# EAGLE design controller13 (EAGLE 8.3.1)

## Sheet 1 of 2
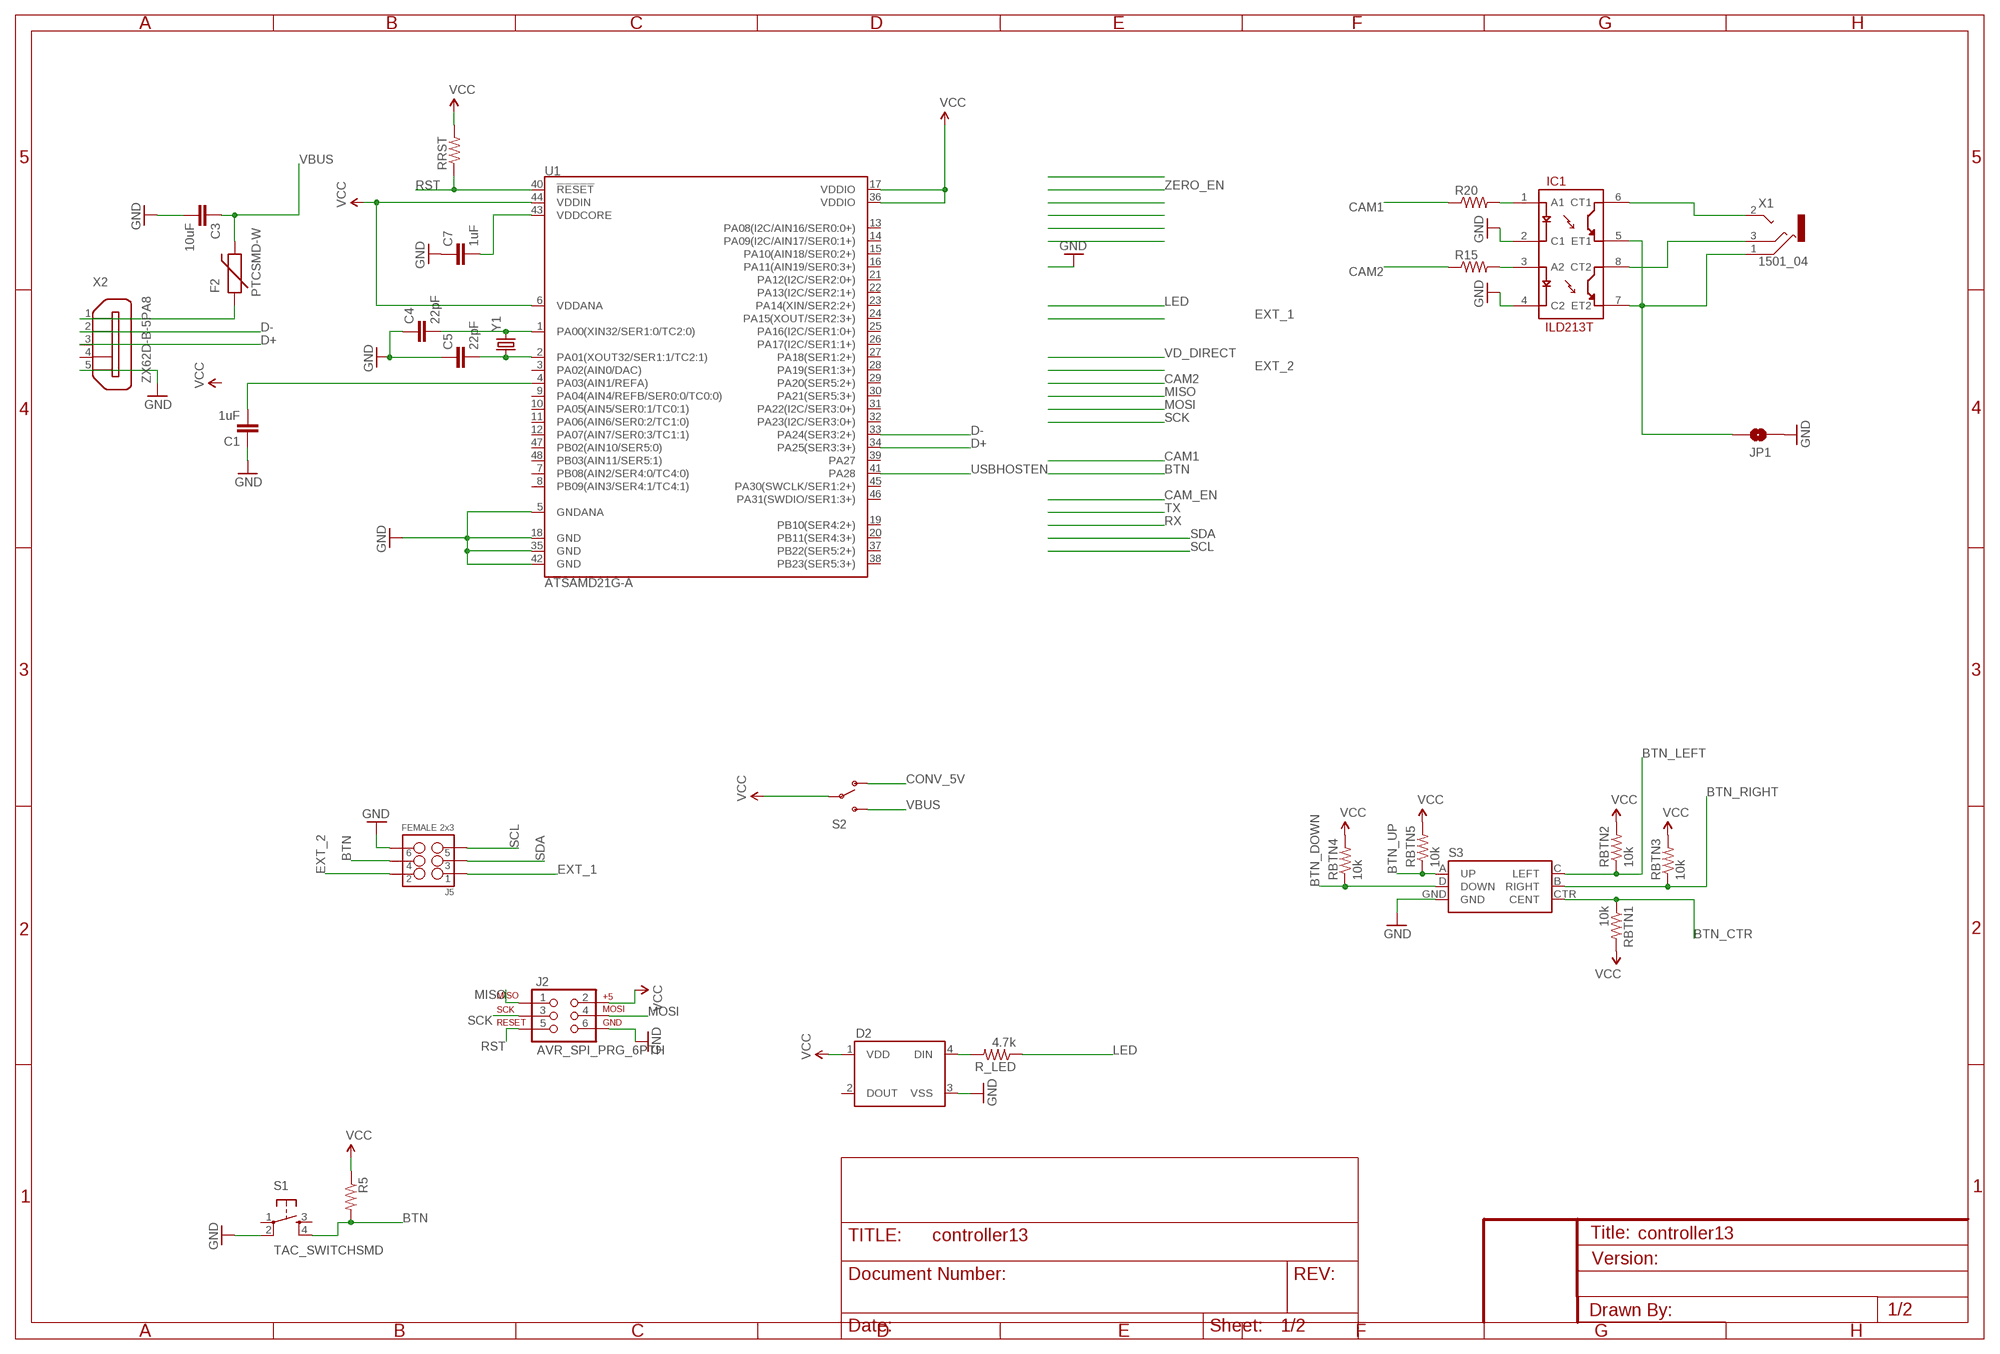
[diagram p0: schematic, sheet 1]

### Parts
C1  1uF  CAP1206  [1206]
C3  10uF  CAP1206  [1206]
C4  22pF  CAP0805  [0805]
C5  22pF  CAP0805  [0805]
C7  1uF  CAP1206  [1206]
D2  WS2812B  [WS2812B]
F2  PTCSMD-W  [PTC-1206-WIDE]
IC1  ILD213T  [SO08]
J2  AVR_SPI_PRG_6PTH  [2X3]
J5  FEMALE 2x3  M03X2FEMALE  [2X3]
JP1  JUMPER-PAD-2-NOYES_SILK  [PAD-JUMPER-2-NO_YES_SILK]
R5  RESISTOR1206  [1206]
R15  RESISTOR1206  [1206]
R20  RESISTOR1206  [1206]
R_LED  4.7k  RESISTOR1206  [1206]
RBTN1  10k  RESISTOR0805-RES  [0805]
RBTN2  10k  RESISTOR0805-RES  [0805]
RBTN3  10k  RESISTOR0805-RES  [0805]
RBTN4  10k  RESISTOR0805-RES  [0805]
RBTN5  10k  RESISTOR0805-RES  [0805]
RRST  RESISTOR0805-RES  [0805]
S1  TAC_SWITCHSMD  TAC_SWITCHPTH  [TACTILE-PTH]
S2  SWITCH-SPDTSMD2  [SWITCH-SPDT-SMD]
S3  JOYSTICK_MINI  [JOYSTICK_MINI]
U1  ATSAMD21G-A  [TQFP-48]
X1  1501_04  [1501_05]
X2  ZX62D-B-5PA8  [ZX62D-B-5PA8]
Y1  CRYSTALCRYSTAL-SMD-5X3-16MHZ  [CRYSTAL-SMD-5X3]

### Nets
BTN: J5.4 R5.2 S1.4
BTN_CTR: RBTN1.1 S3.CTR(CENT)
BTN_DOWN: RBTN4.1 S3.D(DOWN)
BTN_LEFT: RBTN2.1 S3.C(LEFT)
BTN_RIGHT: RBTN3.1 S3.B(RIGHT)
BTN_UP: RBTN5.1 S3.A(UP)
CAM1: R20.1
CAM2: R15.1
CONV_5V [power]: S2.1(O) ; also sheet 2
D+: U1.34(PA25(SER3:3+)) X2.3
D-: U1.33(PA24(SER3:2+)) X2.2
EXT_1: J5.1
EXT_2: J5.2
GND: C1.1 C3.2 C4.1 C5.1 C7.1 D2.3(VSS) IC1.2(C1) IC1.4(C2) J2.6 J5.6 JP1.1 S1.2 S3.GND U1.5(GNDANA) U1.18(GND) U1.35(GND) U1.42(GND) X2.5 ; also sheet 2
LED: R_LED.1
MISO: J2.1
MOSI: J2.4
N$2: C7.2 U1.43(VDDCORE)
N$3 [power]: C1.2
N$7: D2.4(DIN) R_LED.2
N$8: C4.2 Y1.3
N$9: C5.2 Y1.1
N$12: IC1.6(CT1) X1.2
N$13: IC1.8(CT2) X1.3
N$15: IC1.3(A2) R15.2
N$19: IC1.1(A1) R20.2
N$34: IC1.5(ET1) IC1.7(ET2) JP1.2 X1.1
N$38: F2.1 X2.1
RST: J2.5 RRST.1 U1.40(!RESET!)
SCK: J2.3
SCL: J5.5
SDA: J5.3
USBHOSTEN: U1.41(PA28)
VBUS: C3.1 F2.2 S2.3(S)
VCC [power]: D2.1(VDD) J2.2 R5.1 RBTN1.2 RBTN2.2 RBTN3.2 RBTN4.2 RBTN5.2 RRST.2 S2.2(P) U1.6(VDDANA) U1.17(VDDIO) U1.36(VDDIO) U1.44(VDDIN) ; also sheet 2
Unconnected: D2.2(DOUT) S1.1 S1.3 U1.1(PA00(XIN32/SER1:0/TC2:0)) U1.2(PA01(XOUT32/SER1:1/TC2:1)) U1.3(PA02(AIN0/DAC)) U1.4(PA03(AIN1/REFA)) U1.7(PB08(AIN2/SER4:0/TC4:0)) U1.8(PB09(AIN3/SER4:1/TC4:1)) U1.9(PA04(AIN4/REFB/SER0:0/TC0:0)) U1.10(PA05(AIN5/SER0:1/TC0:1)) U1.11(PA06(AIN6/SER0:2/TC1:0)) U1.12(PA07(AIN7/SER0:3/TC1:1)) U1.13(PA08(I2C/AIN16/SER0:0+)) U1.14(PA09(I2C/AIN17/SER0:1+)) U1.15(PA10(AIN18/SER0:2+)) U1.16(PA11(AIN19/SER0:3+)) U1.19(PB10(SER4:2+)) U1.20(PB11(SER4:3+)) U1.21(PA12(I2C/SER2:0+)) U1.22(PA13(I2C/SER2:1+)) U1.23(PA14(XIN/SER2:2+)) U1.24(PA15(XOUT/SER2:3+)) U1.25(PA16(I2C/SER1:0+)) U1.26(PA17(I2C/SER1:1+)) U1.27(PA18(SER1:2+)) U1.28(PA19(SER1:3+)) U1.29(PA20(SER5:2+)) U1.30(PA21(SER5:3+)) U1.31(PA22(I2C/SER3:0+)) U1.32(PA23(I2C/SER3:0+)) U1.37(PB22(SER5:2+)) U1.38(PB23(SER5:3+)) U1.39(PA27) U1.45(PA30(SWCLK/SER1:2+)) U1.46(PA31(SWDIO/SER1:3+)) U1.47(PB02(AIN10/SER5:0)) U1.48(PB03(AIN11/SER5:1)) X2.4 X2.S1 X2.S2 X2.S3 X2.S4

## Sheet 2 of 2
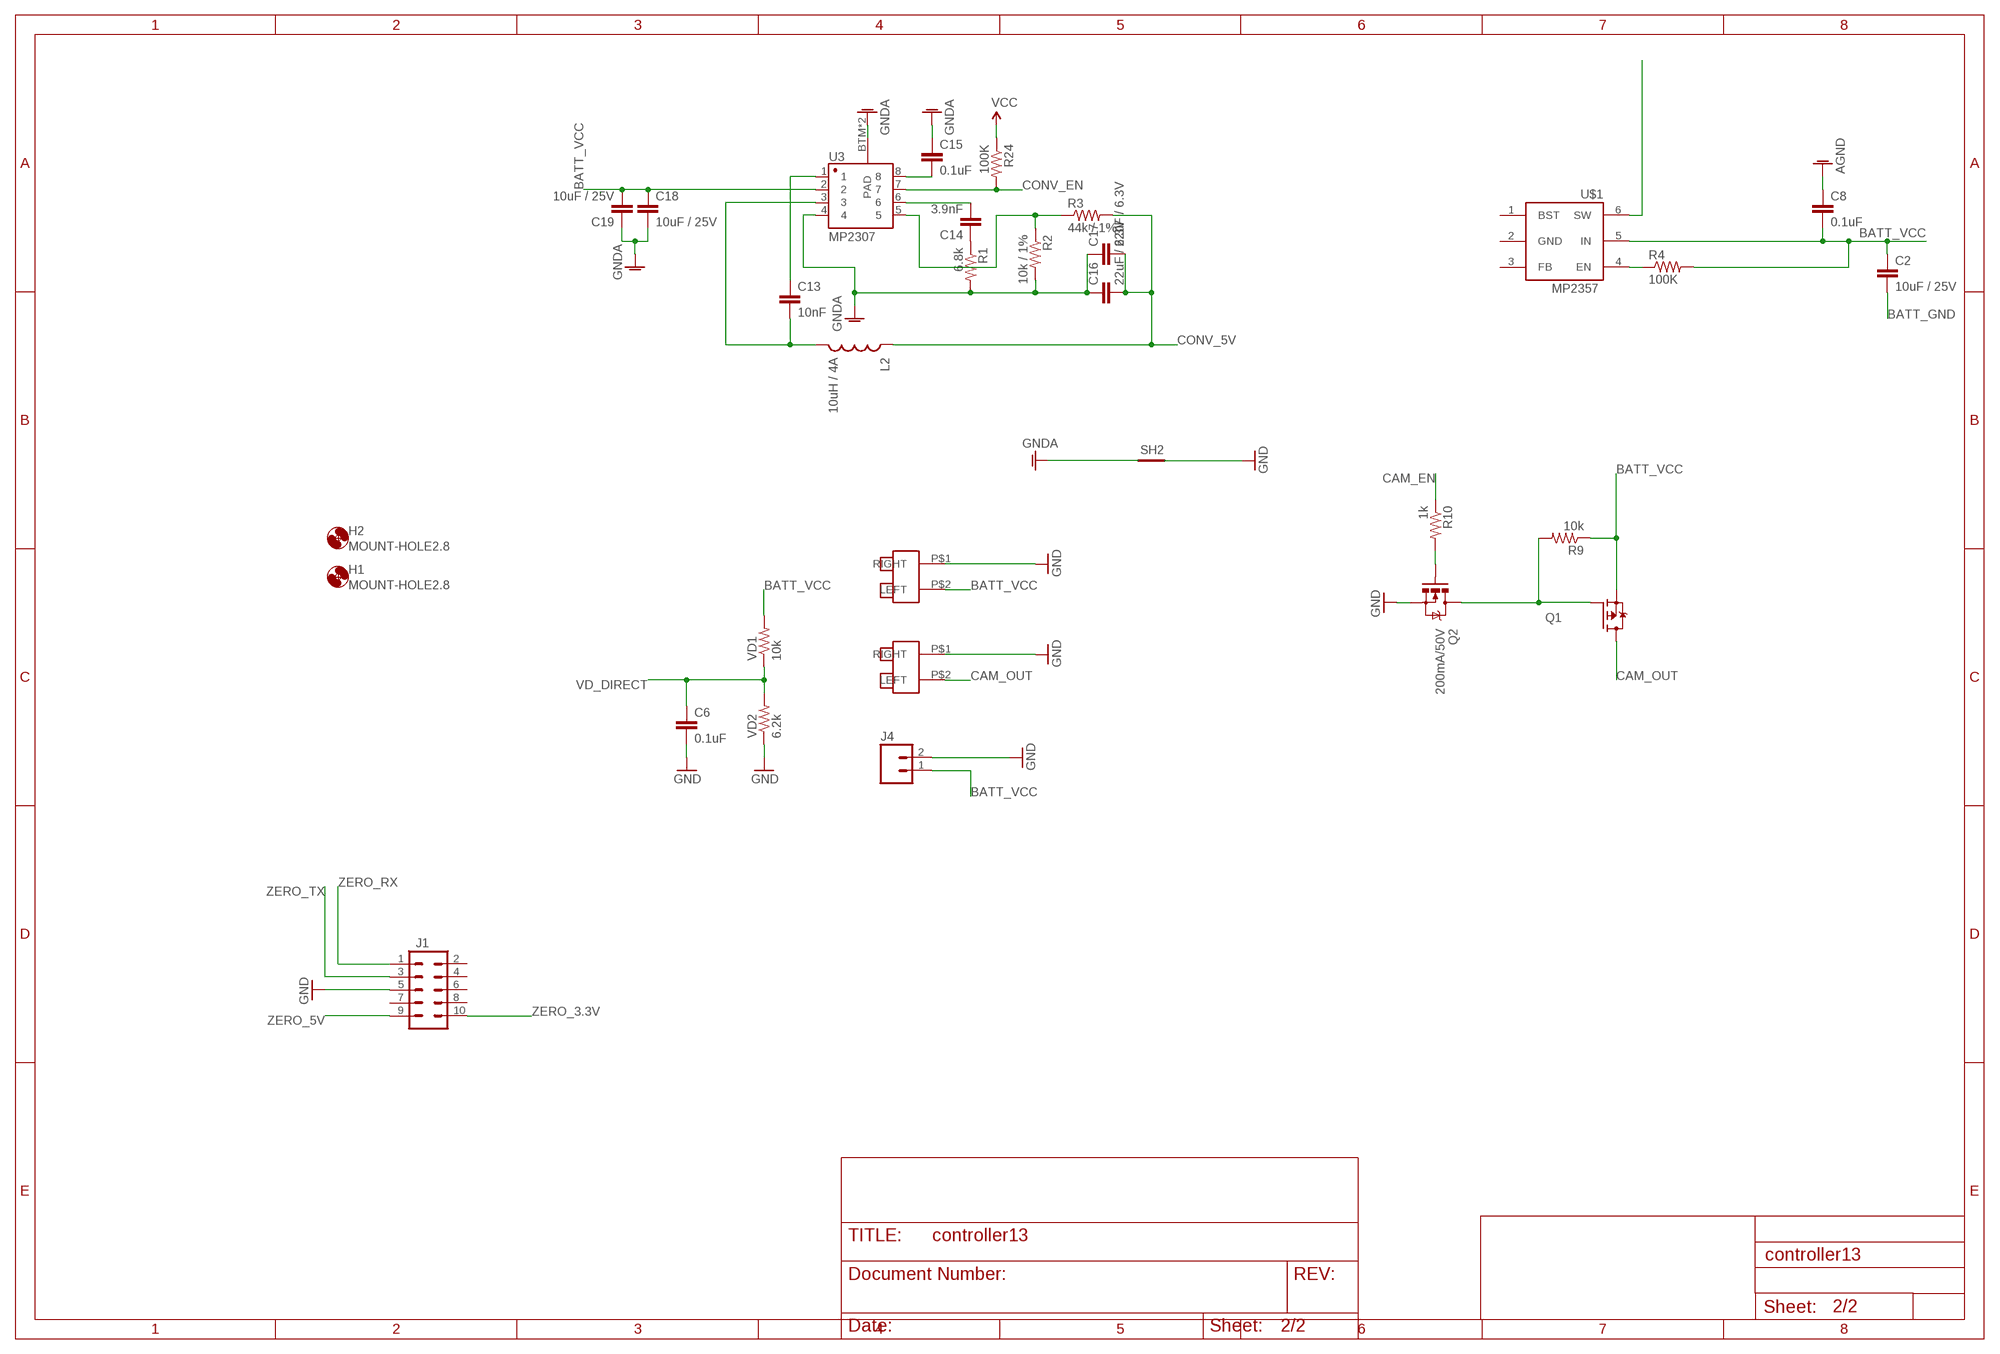
[diagram p1: schematic, sheet 2]

### Parts
C2  10uF / 25V  CAP1210  [1210]
C6  0.1uF  CAP1206  [1206]
C8  0.1uF  CAP0805  [0805]
C13  10nF  CAP1206  [1206]
C14  3.9nF  CAP1206  [1206]
C15  0.1uF  CAP0805  [0805]
C16  22uF / 6.3V  CAP1210  [1210]
C17  22uF / 6.3V  CAP1210  [1210]
C18  10uF / 25V  CAP1210  [1210]
C19  10uF / 25V  CAP1210  [1210]
H1  MOUNT-HOLE2.8  [2,8]
H2  MOUNT-HOLE2.8  [2,8]
J1  M05X2PTH  [AVR_ICSP]
J4  M02PTH  [1X02]
L2  10uH / 4A  INDUCTORSRU1038  [SRU1038]
Q1  FDD4141TO252  [TO252]
Q2  200mA/50V  MOSFET-NCHANNELBSS138  [SOT23-3]
R1  6.8k  RESISTOR0805-RES  [0805]
R2  10k / 1%  RESISTOR1206  [1206]
R3  44k / 1%  RESISTOR1206  [1206]
R4  100K  RESISTOR0805-RES  [0805]
R9  10k  RESISTOR1206  [1206]
R10  1k  RESISTOR1206  [1206]
R24  100K  RESISTOR0805-RES  [0805]
SH2  SHORT-HT5  [SHORT_TOP-50]
U3  MP2307  GENERIC-SOIC8MSGEQ7N-FILTER  [SO08]
U$1  MP2357  [SOT23-6]
U$4  NANOFIT2  [NANOFIT2]
U$5  NANOFIT2  [NANOFIT2]
VD1  10k  RESISTOR1206  [1206]
VD2  6.2k  RESISTOR1206  [1206]

### Nets
AGND: C8.1
BATT_GND: C2.2
BATT_VCC [camera_power]: C2.1 C8.2 C18.1 C19.2 J4.1 Q1.2(S) R4.2 R9.1 U3.2 U$1.5(IN) U$4.P$2(LEFT) VD1.2
CAM_EN: R10.1 ; also sheet 1
CAM_OUT [camera_power]: Q1.3(D) U$5.P$2(LEFT)
CONV_5V [power]: C16.2 C17.2 L2.1 R3.2 ; also sheet 1
CONV_EN: R24.2 U3.7
GND: C6.2 J1.5 J4.2 Q2.2(S) SH2.2 U$4.P$1(RIGHT) U$5.P$1(RIGHT) VD2.1 ; also sheet 1
GNDA [power]: C15.1 C16.1 C17.1 C18.2 C19.1 R1.2 R2.2 SH2.1 U3.4 U3.BTM(PAD) U3.P$1(PAD)
N$1: Q1.1(G) Q2.3(D) R9.2
N$4: R4.1 U$1.4(EN)
N$5: U$1.6(SW)
N$6: Q2.1(G) R10.2
N$25: C15.2 U3.8
N$26 [power]: C13.2 L2.2 U3.3
N$27: C13.1 U3.1
N$28: C14.1 R1.1
N$29: C14.2 U3.6
N$30: R2.1 R3.1 U3.5
VCC [power]: R24.1 ; also sheet 1
VD_DIRECT: C6.1 VD1.1 VD2.2 ; also sheet 1
ZERO_3.3V: J1.10
ZERO_5V [power]: J1.9
ZERO_RX: J1.1
ZERO_TX: J1.3
Unconnected: J1.2 J1.4 J1.6 J1.7 J1.8 U$1.1(BST) U$1.3(FB)

## Power pins joined to a net without a drawn wire
GND: U$1.2(GND)

## Library data of the parts
C1 C2 C6-C8 C13-C19 = SparkFun-Capacitors:CAP: Capacitor Standard 0603 ceramic capacitor, and 0.1" leaded capacitor.
C3-C5 = SparkFun-Passives:CAP: Capacitor Standard 0603 ceramic capacitor, and 0.1" leaded capacitor.
D2 = SparkFun-LED:WS2812B: WS2812B - Intelligent control LED integrated light source Technical Specifications: Power Supply Voltage (VDD): 3.5 to 5.3 V Input Voltage (VI): -0.5 to VDD+0.5 V Operating Junction Temperature (Topt): -25°C to +80°C Storage Temperature Range (Tstg): -55°C to +150°C; PROD_ID: DIO-12503
F2 = SparkFun-PowerIC:PTC: Resettable Fuse PTC Resettable Fuse. Spark Fun Electronics SKU : COM-08357
H1 H2 = holes:MOUNT-HOLE: MOUNTING HOLE with drill center marker
IC1 = SparkFun-DiscreteSemi:ILD213T: Dual optoisolator.
J1 = SparkFun-Connectors:M05X2: Header 5x2 Standard 10-pin dual row 0.1" header. Commonly used with AVR-ISP. Use with Spark Fun Electronics SKU: PRT-00778
J2 = SparkFun-Connectors:AVR_SPI_PRG_6: AVR ISP 6 Pin This is the reduced ISP connector for AVR programming. Common on Arduino. This footprint will take up less PCB space and can be used with a 10-pin to 6-pin adapter such as SKU: BOB-08508 **Special note about "TEST_POINT" package. The stop mask is on the top side, so if you want your programming test points to be on the bottom of your board, make sure to place this package on the bottom side of the board. This also ensure that the orientation to program from the bottom side will be correct.
J4 = SparkFun-Connectors:M02: Standard 2-pin 0.1" header. Use with - straight break away headers ( PRT-00116) - right angle break away headers (PRT-00553) - swiss pins (PRT-00743) - machine pins (PRT-00117) - female headers (PRT-00115) Molex polarized connector foot print use with: PRT-08233 with associated crimp pins and housings. 2.54_SCREWTERM for use with PRT-10571. 3.5mm Screw Terminal footprints for PRT-08084 5mm Screw Terminal footprints for use with PRT-08432
J5 = SparkFun-Connectors:M03X2: 2x3 .1" header. Shrouded, with keying- CONN-10681 SMT- CONN-11415 Pogo pins- HW-11044; PROD_ID: CONN-11566
JP1 = SparkFun-Passives:JUMPER-PAD-2-NO
L2 = SparkFun-Passives:INDUCTOR: Inductors Basic Inductor/Choke - 0603 and 1206. Footprints are not proven and vary greatly between part numbers. INDUCTOR POWER 3.3UH 4.0A SMD 0.197" L x 0.197" W x 0.177" H (5.00mm x 5.00mm x 4.50mm)
Q1 = transistor-fet:FDD4141: P-Channel PowerTrench® MOSFET Source: FDD4141.pdf
Q2 = SparkFun-DiscreteSemi:MOSFET-NCHANNEL: Common NMOSFET Parts MFG P/N Store ID Prod ID FDD8780 TRANS-09984 SI7820DN TRANS-11055 FDS6630A IC-08089 2N7002PW TRANS-11151 FQP30N06L COM-10213 TRANS-10060 BSS123LT1G TRANS-08345 BSS138 TRANS-00830 BS170 2N7000; PROD_ID: TRANS-00830
R1-R4 R9 R10 R24 R_LED RBTN1-RBTN5 = SparkFun-Resistors:RESISTOR: Resistor Basic schematic elements and footprints for 0603, 1206, and PTH resistors.
R5 R15 R20 RRST VD1 VD2 = SparkFun-Passives:RESISTOR: Resistor Basic schematic elements and footprints for 0603, 1206, and PTH resistors.
S1 = SparkFun-Retired:TAC_SWITCH: Momentary Switch Button commonly used for reset or general input. Spark Fun Electronics SKU : COM-00097 SMT- SWCH-08247
S2 = SparkFun-Electromechanical:SWITCH-SPDT: SPDT Switch Simple slide switch, Spark Fun Electronics SKU : COM-00102 DPDT SMT slide switch, AYZ0202, SWCH-08179
S3 = SparkFun-Electromechanical:JOYSTICK_MINI: Small 5-way tactile joystick, COM-10063 4UCON SF303GJ26; PROD_ID: SWCH-09905
SH2 = shorts:SHORT-H: Short between two nets; BOM: no
U1 = SparkFun-DigitalIC:ATSAMD21G: Atmel SAMD21G SMART ARM-Based Microcontroller The Atmel ® | SMART ™ SAM D21 is a series of low-power microcontrollers using the 32-bit ARM ® Cortex ® -M0+ processor, and ranging from 32- to 64-pins with up to 256KB Flash and 32KB of SRAM. The SAM D21 devices operate at a maximum frequency of 48MHz and reach 2.46 CoreMark/MHz. They are designed for simple and intuitive migration with identical peripheral modules, hex compatible code, identical linear address map and pin compatible migration paths between all devices in the product series. All devices include intelligent and flexible peripherals, Atmel Event System for inter-peripheral signaling, and support for capacitive touch button, slider and wheel user interfaces.; PROD_ID: IC-13064
U3 = SparkFun-AnalogIC:GENERIC-SOIC8: A placeholder for generic narrow & wide SOIC8 foorptints - used on the DIP adapter board.; PROD_ID: IC-10141
U$1 = volzolib:MP2357
U$4 U$5 = volzolib:NANOFIT2
X1 = con-lumberg:1501_0*: Jack connectors according to JISC 6560, 2.5 mm Klinkensteckverbinder nach JISC 6560, 2,5 mm Source: http://www.lumberg.com/Produkte/PDFs/1501_05.pdfedit 1501_03 http://www.lumberg.com/Produkte/PDFs/1501_06.pdf; OC_FARNELL: 1216977; OC_NEWARK: unknown
X2 = zx62d-b-5pa8-oshpark_10:ZX62D-B-5PA8: Micro USB Type B Connector - Standard, Shell Through Hole Source: http://www.hirose.co.jp/cataloge_hp/ed_ZX_20140804.pdf; MF: Hirose; MPN: ZX62D-B-5PA8; OC_FARNELL: 2300438; OC_NEWARK: 69W0712
Y1 = SparkFun-FreqCtrl:CRYSTAL: Various standard crystals. Proven footprints.; PROD_ID: XTAL-08218

## Net classes
0 default: width 0.254 mm, clearance 0.254 mm
1 power: width 0.381 mm, clearance 0.254 mm
2 camera_power: width 0.66 mm, clearance 0.254 mm
3 usbsignal: width 0.254 mm, clearance 0.203 mm

## Board
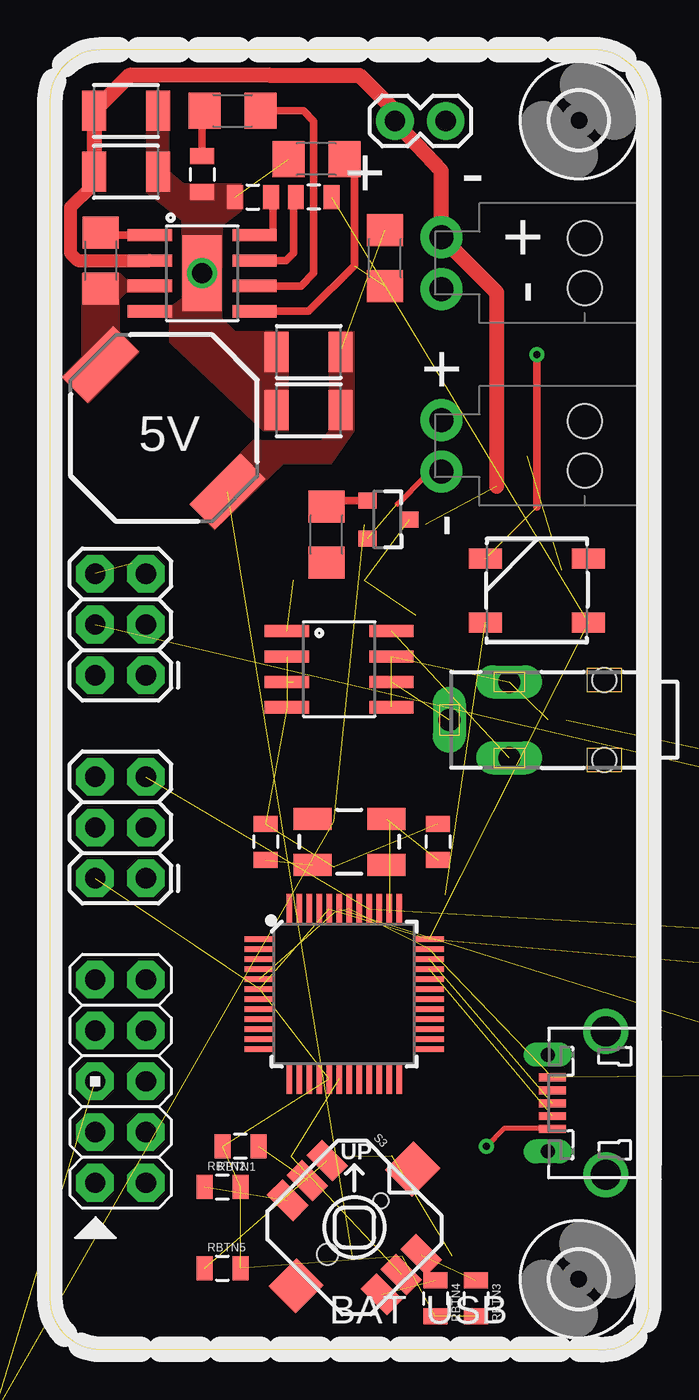
[diagram p2: board, top side]
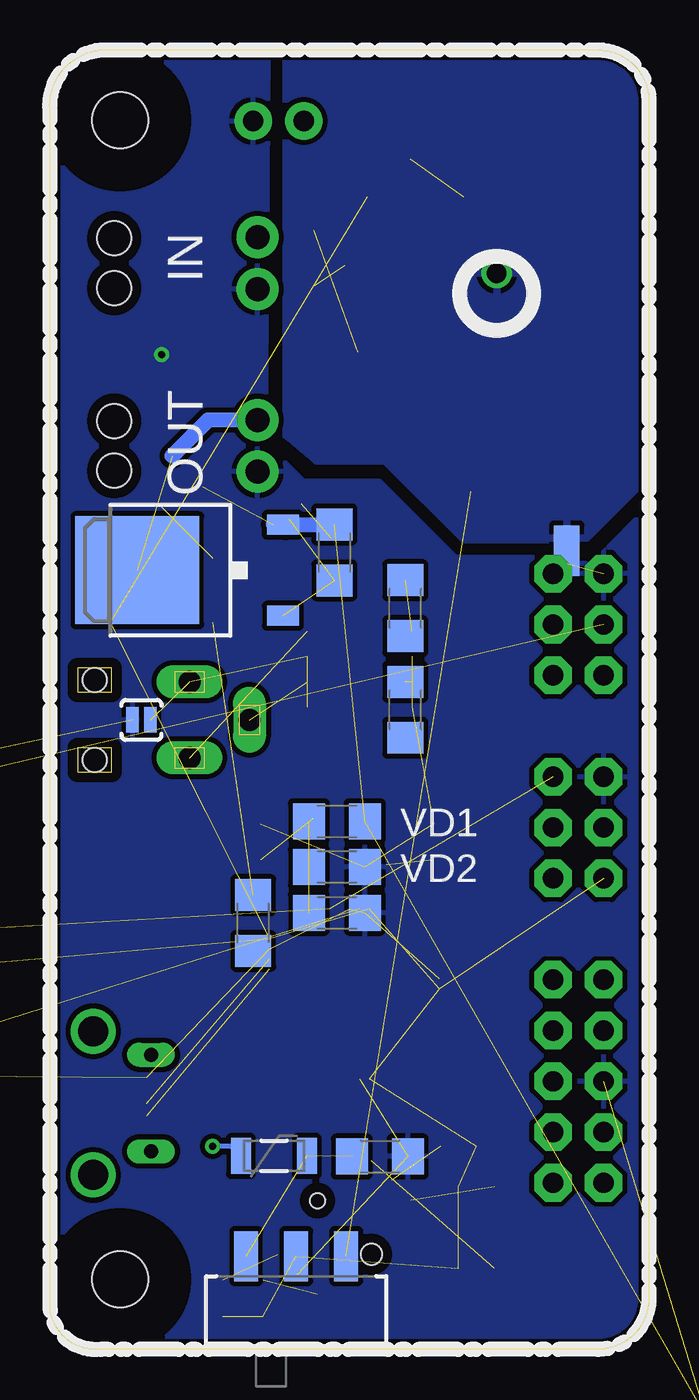
[diagram p3: board, bottom side, seen from below]

Size 29.98 x 65.04 mm. Coordinates in mm from the lower left corner, seen from the top.
Outline: 0,2.55 arc90 2.54,0.01 27.43,0.01 arc90 29.97,2.05 29.97,61.99 arc90 27.43,65.04 2.54,65.04 arc90 0,62.5 0,2.55
Copper layers (1*16): Top 0.035mm / dielectric 1.5mm / Bottom 0.035mm
Design rules "default *": minimum track width 10mil, minimum drill 24mil, track to track 8mil, track to pad 8mil, pad to pad 8mil, via to via 8mil, smd to smd 8mil, copper to edge 20mil, drill to drill 8mil, minimum pad ring 10mil, minimum via ring 8mil, stop-mask expansion 4mil, vias tented up to drill 25mil, thermal gap 10mil

### Footprints (pad centres in the part's own frame; a part is rotated, then mirrored left to right if it is on the bottom)
1206 = smd 1.6 x 1.8: 1 -1.4,0; 2 1.4,0
1210 = smd 1.2 x 2: 1 -1.6,0; 2 1.6,0
0805 = smd 0.8 x 1.2: 1 -0.9,0; 2 0.9,0
WS2812B = smd 1.651 x 1: 1 -2.577,1.6; 2 -2.577,-1.6; 3 2.577,-1.6; 4 2.577,1.6
PTC-1206-WIDE = smd 1 x 1.8: 1 -1.654,0; 2 1.654,0
2,8 = hole 2.8: 0,0
SO08 = smd 0.61 x 2.21: 1 -1.905,-2.616; 2 -0.635,-2.616; 3 0.635,-2.616; 4 1.905,-2.616; 5 1.905,2.616; 6 0.635,2.616; 7 -0.635,2.616; 8 -1.905,2.616
AVR_ICSP = drill 1.016 pad 1.88 octagon: 1 -1.27,5.08; 2 1.27,5.08; 3 -1.27,2.54; 4 1.27,2.54; 5 -1.27,0; 6 1.27,0; 7 -1.27,-2.54; 8 1.27,-2.54; 9 -1.27,-5.08; 10 1.27,-5.08
2X3 = drill 1.016 pad 1.88 octagon: 1 0,0; 2 0,2.54; 3 2.54,0; 4 2.54,2.54; 5 5.08,0; 6 5.08,2.54
1X02 = drill 1.016 pad 1.88: 1 0,0; 2 2.54,0
PAD-JUMPER-2-NO_YES_SILK = smd 0.635 x 1.27: 1 -0.45,0; 2 0.45,0
SRU1038 = smd 1.8 x 3.6: 1 -4.5,0; 2 4.5,0
TO252 = smd 1 x 1.6: 1 -2.28,-4.8; 2 2.28,-4.8 | smd 5.4 x 6.2: 3 0,2.5
SOT23-3 = smd 0.8 x 0.9: 1 -0.95,-1; 2 0.95,-1; 3 0,1.1
TACTILE-PTH = drill 1.016 pad 1.88: 1 -3.251,2.261; 2 3.251,2.261; 3 -3.251,-2.261; 4 3.251,-2.261
SWITCH-SPDT-SMD = smd 1.2 x 2.5: 1 -2.5,-2.75; 2 0,-2.75; 3 2.5,-2.75
JOYSTICK_MINI = smd 1.85 x 1.1: A -3.325,1.4; B 3.325,1.4; C -3.325,-1.4; CTR -3.325,0; D 3.325,-1.4; GND 3.325,0 | smd 1.9 x 2: NC 0,4.13; NC@0 0,-4.13 | hole 0.75: 0,1.9 | hole 1.05: 0,-1.9
SHORT_TOP-50 = smd 1.27 x 1.27: 1 0.635,0; 2 -0.635,0
TQFP-48 = smd 1.5 x 0.28: 1 -4.25,2.75; 2 -4.25,2.25; 3 -4.25,1.75; 4 -4.25,1.25; 5 -4.25,0.75; 6 -4.25,0.25; 7 -4.25,-0.25; 8 -4.25,-0.75; 9 -4.25,-1.25; 10 -4.25,-1.75; 11 -4.25,-2.25; 12 -4.25,-2.75; 25 4.25,-2.75; 26 4.25,-2.25; 27 4.25,-1.75; 28 4.25,-1.25; 29 4.25,-0.75; 30 4.25,-0.25; 31 4.25,0.25; 32 4.25,0.75; 33 4.25,1.25; 34 4.25,1.75; 35 4.25,2.25; 36 4.25,2.75 | smd 0.28 x 1.5: 13 -2.75,-4.25; 14 -2.25,-4.25; 15 -1.75,-4.25; 16 -1.25,-4.25; 17 -0.75,-4.25; 18 -0.25,-4.25; 19 0.25,-4.25; 20 0.75,-4.25; 21 1.25,-4.25; 22 1.75,-4.25; 23 2.25,-4.25; 24 2.75,-4.25; 37 2.75,4.25; 38 2.25,4.25; 39 1.75,4.25; 40 1.25,4.25; 41 0.75,4.25; 42 0.25,4.25; 43 -0.25,4.25; 44 -0.75,4.25; 45 -1.25,4.25; 46 -1.75,4.25; 47 -2.25,4.25; 48 -2.75,4.25
SO08' = smd 0.61 x 2.21: 1 -1.905,-2.616; 2 -0.635,-2.616; 3 0.635,-2.616; 4 1.905,-2.616; 5 1.905,2.616; 6 0.635,2.616; 7 -0.635,2.616; 8 -1.905,2.616 | smd 3.81 x 1.93: BTM 0,0 | drill 1: P$1 0,0
SOT23-6 = smd 0.55 x 1.2: 1 -0.95,-1.3; 2 0,-1.3; 3 0.95,-1.3; 4 0.95,1.3; 5 0,1.3; 6 -0.95,1.3
NANOFIT2 = drill 1.2 pad 2.1: P$1 10.38,1.3; P$2 10.38,-1.3 | hole 1.7: 3.2,1.25; 3.2,-1.25
1501_05 = drill 1.1 pad 1.4 long: 1 -1.9,-8.5; 2 0,-11.5; 3 1.9,-8.5 | hole 1.2: -2,-3.75; 2,-3.75
ZX62D-B-5PA8 = smd 1.35 x 0.4: 1 4.825,1.3; 2 4.825,0.65; 3 4.825,0; 4 4.825,-0.65; 5 4.825,-1.3 | drill 1.5: S1 2.15,-3.6; S2 2.15,3.6 | drill 0.7 long: S3 5.05,2.425; S4 5.05,-2.425
CRYSTAL-SMD-5X3 = smd 1.9 x 1.1: 1 -1.85,-1.15; 2 1.85,-1.15; 3 1.85,1.15; 4 -1.85,1.15

### Placement (x,y rotation side)
C1  39.12,6.36 0 top  (outside the outline)
C2  -9.65,-8.11 0 top  (outside the outline)
C3  13.46,9.67 0 bottom
C4  10.79,25.41 270 top
C5  19.43,25.41 270 top
C6  15.62,21.86 0 bottom
C7  39.62,13.73 0 top  (outside the outline)
C8  -16.76,-9.13 0 top  (outside the outline)
C13  2.54,54.5 270 top
C14  9.14,61.99 0 top
C15  10.16,57.67 0 top
C16  12.95,49.92 0 top
C17  12.95,47 0 top
C18  3.81,61.99 0 top
C19  3.81,58.94 180 top
D2  24.38,37.99 180 top
F2  18.77,9.69 0 bottom
H1  26.47,3.52 0 top
H2  26.48,61.52 0 top
IC1  14.48,34.05 270 top
J1  3.53,13.42 0 top
J2  4.8,23.58 90 top
J4  17.27,61.48 0 top
J5  4.8,33.74 90 top
JP1  25.4,31.51 0 bottom
L2  5.71,46.11 135 top
Q1  23.11,39 90 bottom
Q2  16.89,41.54 270 top
R1  7.62,58.81 270 top
R2  13.34,59.58 180 top
R3  16.76,54.62 90 top
R4  -13.72,-9.13 0 top  (outside the outline)
R5  44.83,32.4 0 bottom  (outside the outline)
R9  15.75,39.89 270 bottom
R10  13.84,40.78 90 top
R15  12.19,32.02 90 bottom
R20  12.19,37.1 90 bottom
R24  13.21,57.67 180 top
R_LED  19.81,21.35 90 bottom
RBTN1  9.54,10.17 180 top
RBTN2  8.64,8.14 0 top
RBTN3  21.34,2.55 270 top
RBTN4  19.3,2.55 270 top
RBTN5  8.64,4.08 0 top
RRST  34.8,20.08 270 top  (outside the outline)
S1  37.08,31.89 270 top  (outside the outline)
S2  17.65,1.92 180 bottom
S3  15.24,6.11 315 top
SH2  4.11,39.97 90 bottom
U1  14.73,17.79 0 top
U3  MP2307  [SO08']  7.62,53.86 270 top
U$1  -4.57,-7.61 0 top  (outside the outline)
U$4  29.97,54.37 180 top
U$5  29.97,45.23 180 top
VD1  15.62,26.43 0 bottom
VD2  15.62,24.14 180 bottom
X1  31.5,31.51 270 top
X2  29.97,12.33 180 top
Y1  14.99,25.41 180 top

### Tracks (layer width: path | path; a pad name or v marks a point on that pad's centre or on a via)
BATT_VCC  (6 unrouted)
  Top 0.66: 2.29,61.74 C18.1 | U3.2 1.4,54.5 1.02,54.88 1.02,57.16 2.03,58.18 C19.2
  Top 0.762: 2.21,61.66 C19.2 | 2.21,61.66 2.29,61.74 | C18.1 2.41,61.74 | 2.29,62.24 2.21,62.17 C18.1 | C18.1 2.21,61.66 | C18.1 3.99,63.77 11.05,63.77 | 22.35,43.19 22.35,52.91 U$4.P$2 19.59,58.98 J4.1 17.27,61.99 15.49,63.77 11.05,63.77 | 11.05,63.76 11.05,63.77
  Bottom 0.762: 18.18,41.15 Q1.2 | Q1.2 R9.1 | 18.8,41.29 Q1.2
BTN  (2 unrouted)
BTN_CTR  (1 unrouted)
BTN_DOWN  (1 unrouted)
BTN_LEFT  (1 unrouted)
BTN_RIGHT  (1 unrouted)
BTN_UP  (1 unrouted)
CAM_OUT  (1 unrouted)
  Bottom 0.762: U$5.P$2 22.07,46.53 23.88,44.72
CONV_5V  (2 unrouted)
  pour Top (no thermals): 13.97,45.99 13.59,45.48 10.16,45.48 6.99,42.3 8.26,41.03 11.68,44.34 14.1,44.34 15.24,45.99 15.24,50.94 13.97,50.94
CONV_EN
  Top 0.381: U3.7 11.81,54.5 12.19,54.88 12.19,57.56 R24.2
D+  (1 unrouted)
D-  (1 unrouted)
GND  (via drill 0.35)  (17 unrouted)
  Top 0.254: 17.38,42.32 17.42,42.32 18.8,43.7 19.37,43.7 U$5.P$1
  Top 0.381: 24.38,42.16 v24.38,49.8
  pour Bottom: 29.84,0.01 0,0.01 0,42.18 2.54,39.64 9.65,39.64 13.46,43.45 17.27,43.45 19.18,45.35 19.05,65.16 29.84,65.04
GNDA  (1 unrouted)
  pour Top (no thermals): 11.94,50.97 9.27,50.94 8.61,51.6 8.61,51.91 8.64,56.27 9.6,56.99 9.6,58.36 6.71,58.33 5.97,58.94 5.97,62.88 4.83,62.88 4.83,57.93 6.6,56.53 6.6,52.59 6.1,52.21 3.94,52.21 3.94,51.7 5.97,51.7 5.97,50.43 6.1,50.31 10.67,45.99 11.94,45.99
  pour Bottom: 0,65.29 0,43.7 3.17,40.53 9.27,40.53 13.21,44.46 16.64,44.46 18.16,45.73 18.16,65.29
N$1  (2 unrouted)
N$2  (1 unrouted)
N$4  (1 unrouted)
N$6
  Top 0.381: Q2.1 14.04,42.49 R10.2
N$7  (1 unrouted)
N$8  (1 unrouted)
N$9  (1 unrouted)
N$12  (1 unrouted)
N$13  (1 unrouted)
N$15  (1 unrouted)
N$19  (1 unrouted)
N$25
  Top 0.381: C15.2 11.18,57.56 11.18,55.89 11.05,55.77 U3.8
N$26
  pour Top (no thermals): 5.97,53.48 3.81,53.48 3.43,53.86 1.65,53.86 1.65,49.67 0.64,48.65 1.91,47.38 4.45,49.92 3.43,50.94 3.43,52.59 3.81,52.97 5.97,52.97
N$27
  Top 0.381: U3.1 2.67,55.77 C13.1
N$28
  Top 0.381: 7.87,61.97 8.38,61.87 | 7.87,61.97 C14.1 | R1.1 7.62,61.72 7.87,61.97
N$29
  Top 0.381: U3.6 12.57,53.23 13.21,53.86 13.21,61.48 12.7,61.99 C14.2
N$30  (1 unrouted)
  Top 0.381: U3.5 12.96,51.96 15.24,54.24 15.24,59.96 14.86,59.58 R2.1
N$34  (3 unrouted)
N$38  (via drill 0.35)
  Top 0.254: X2.1 25.12,11.06 22.73,11.06 v21.84,10.17
  Bottom 0.254: F2.1 20.91,10.17 v21.84,10.17
RST  (2 unrouted)
VBUS  (2 unrouted)
VCC  (14 unrouted)
VD_DIRECT  (2 unrouted)

### Text on the board
tPlace: + | - | + | - | + | 5V | - | TIME | BOX | 13 | BAT | USB
bPlace: IN | OUT | VD1 | VD2